# Altium schematic sheet Power.SchDoc
size A; SheetNumber: roneV11-Power; SheetTotal: 6
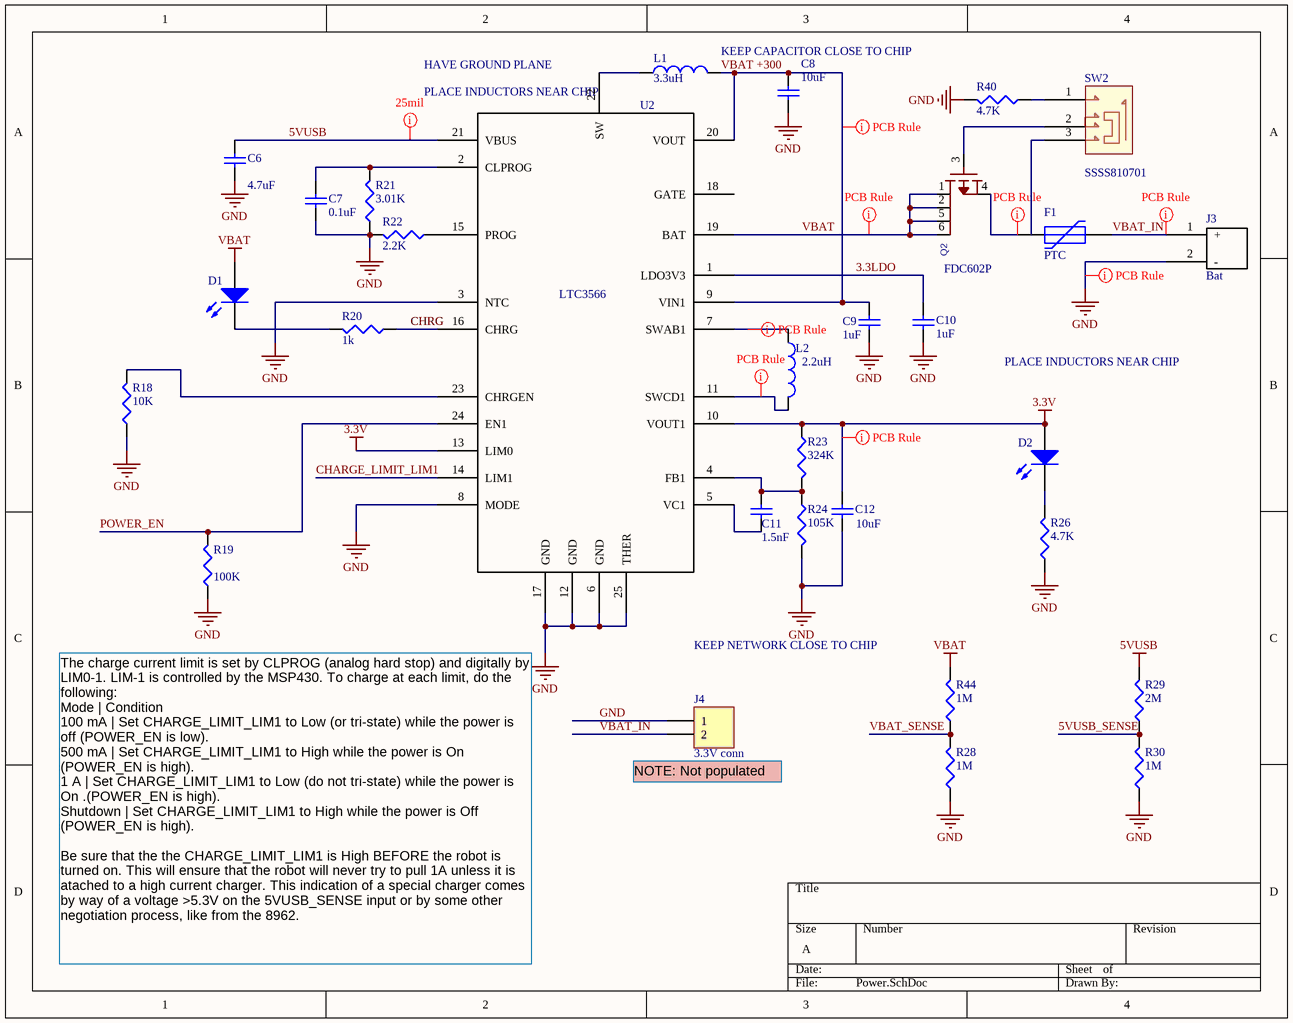
[diagram p0: Power.SchDoc]

## Parts
C6  value 4.7uF  [CAPC1608L]  (hidden comment: Cap Semi)
C7  value 0.1uF  [CAPC1005L]  (hidden comment: Cap)
C8  value 10uF  [CAPC1608L]  (hidden comment: Cap)
C9  value 1uF  [CAPC1608L]  (hidden comment: Cap)
C10  value 1uF  [CAPC1608L]  (hidden comment: Cap)
C11  value 1.5nF  [CAPC1005L]  (hidden comment: Cap)
C12  value 10uF  [CAPC1608L]  (hidden comment: Cap)
D1  Charge  [INDC2012L]  (value not drawn)
D2  Power  [INDC2012L]  (value not drawn)
F1  PTC  [ERJ8G-1206]
J3  Bat  [BatteryConnJST]
J4  3.3V conn  [HDR1X2]
L1  3.3uH  [IndPow]
L2  2.2uH  [IndPow]
Q2  Part Number: FDC602P  [SOT23-6]  (hidden comment: Q_MOSFETP4D_SOT23-6)
R18  value 10K  [RESC1608L]  (hidden comment: Res3)
R19  value 100K  [RESC1608L]  (hidden comment: Res3)
R20  value 1k  [RESC1608L]  (hidden comment: Res3)
R21  value 3.01K  [RESC1608L]  (hidden comment: Res3)
R22  value 2.2K  [RESC1608L]  (hidden comment: Res3)
R23  value 324K  [RESC1608L]  (hidden comment: Res3)
R24  value 105K  [RESC1608L]  (hidden comment: Res3)
R26  value 4.7K  [RESC1608L]  (hidden comment: Res3)
R28  value 1M  [RESC1608L]  (hidden comment: Res3)
R29  value 2M  [RESC1608L]  (hidden comment: Res3)
R30  value 1M  [RESC1608L]  (hidden comment: Res3)
R40  value 4.7K  [RESC1608L]  (hidden comment: Res3)
R44  value 1M  [RESC1608L]  (hidden comment: Res3)
SW2  S_SSSS810701_SSSS810701  [SSSS810701]  (value not drawn)
U2  LTC3566  [QFN-24]

## Nets
3.3V: C12.2 D2.1(A) R23.1 U2.10(VOUT1) U2.13(LIM0)
5VUSB: C6.2 R29.2 U2.21(VBUS)
GND: C6.1 C7.1 C8.1 C9.2 C10.2 C12.1 J3.2(-) J4.1 R18.1 R19.1 R21.1 R22.2 R24.2 R26.1 R28.1 R30.1 R40.2 U2.3(NTC) U2.6(GND) U2.8(MODE) U2.12(GND) U2.17(GND) U2.25(THER)
VBAT: D1.1(A) Q2.1(D) Q2.2(D) Q2.5(D) Q2.6(D) R44.2 U2.19(BAT)
3.3LDO: C10.1 U2.1(LDO3V3)
5VUSB_SENSE: R29.1 R30.2
CHARGE_LIMIT_LIM1: U2.14(LIM1)
CHRG: R20.1 U2.16(CHRG)
POWER_EN: R19.2 U2.24(EN1)
VBAT +300: C8.2 C9.1 L1.2 U2.9(VIN1) U2.20(VOUT)
VBAT_IN: F1.2 J3.1(+) J4.2
VBAT_SENSE: R28.2 R44.1
NetC7_2: C7.2 R21.2 U2.2(CLPROG)
NetC11_1: C11.1 R23.2 R24.1 U2.4(FB1)
NetC11_2: C11.2 U2.5(VC1)
NetD1_2: D1.2(K) R20.2
NetD2_2: D2.2(K) R26.2
NetF1_1: F1.1 Q2.4(S)
NetL1_1: L1.1 U2.22(SW)
NetL2_1: L2.1 U2.7(SWAB1)
NetL2_2: L2.2 U2.11(SWCD1)
NetQ2_3: Q2.3(G) SW2.2
NetR18_2: R18.2 U2.23(CHRGEN)
NetR22_1: R22.1 U2.15(PROG)
NetR40_1: R40.1 SW2.1

Not connected (* = marked no-connect by the designer): SW2 3; U2 18(GATE)

## Layout directives
rule Width Constraint [Pref Width = 25mil    Min Width = 10mil    Max Width = 25mil]: 5VUSB, GND, NetL2_1, NetL2_2, VBAT +300
rule Width Constraint [Pref Width = 25mil    Min Width = 10mil    Max Width = 100mil]: 3.3V
rule Width Constraint [Pref Width = 25mil    Min Width = 10mil    Max Width = 50mil]: NetF1_1, VBAT
rule Width Constraint [Pref Width = 25mil    Min Width = 10mil    Max Width = 40mil]: VBAT_IN

## Notes on the sheet
- (near U2) HAVE GROUND PLANE
- (near U2) PLACE INDUCTORS NEAR CHIP
- KEEP CAPACITOR CLOSE TO CHIP
- CHRG
- PLACE INDUCTORS NEAR CHIP
- KEEP NETWORK CLOSE TO CHIP
- (near J4) NOTE: Not populated
- The charge current limit is set by CLPROG (analog hard stop) and digitally by LIM0-1. LIM-1 is controlled by the MSP430. To charge at each limit, do the following:
  Mode	| Condition
  100 mA	| Set CHARGE_LIMIT_LIM1 to Low (or tri-state) while the power is off (POWER_EN is low).
  500 mA	| Set CHARGE_LIMIT_LIM1 to High while the power is On (POWER_EN is high).
  1 A	| Set CHARGE_LIMIT_LIM1 to Low (do not tri-state) while the power is On .(POWER_EN is high).
  Shutdown | Set CHARGE_LIMIT_LIM1 to High while the power is Off (POWER_EN is high).
  Be sure that the the CHARGE_LIMIT_LIM1 is High BEFORE the robot is turned on. This will ensure that the robot will never try to pull 1A unless it is atached to a high current charger. This indication of a special charger comes by way of a voltage >5.3V on the 5VUSB_SENSE input or by some other negotiation process, like from the 8962.

## Library data of the parts
C6 = Cap Semi: Capacitor (Semiconductor SIM Model); Part Number: JMK107BJ475KA-T; Manufacturer: Taiyo Yuden; Published: 8-Jun-2000; LatestRevisionDate: 29-May-2009; LatestRevisionNote: IPC-7351 Footprint Added.; PackageReference: C1206; Publisher: Altium Limited; PackageDescription: Chip Capacitor
C7 = Cap: Capacitor; Part Number: GRM155R71C104KA88D; Manufacturer: Murata; Published: 8-Jun-2000; LatestRevisionDate: 17-Jul-2002; LatestRevisionNote: Re-released for DXP Platform.; PackageReference: RAD-0.3; Publisher: Altium Limited
C8 C12 = Cap: Capacitor; Part Number: GRM188R60J106ME47J; Manufacturer: Murata; Published: 8-Jun-2000; LatestRevisionDate: 17-Jul-2002; LatestRevisionNote: Re-released for DXP Platform.; PackageReference: RAD-0.3; Publisher: Altium Limited
C9 C10 = Cap: Capacitor; Part Number: LMK107B7105KA-T; Manufacturer: Taiyo Yuden; Published: 8-Jun-2000; LatestRevisionDate: 17-Jul-2002; LatestRevisionNote: Re-released for DXP Platform.; PackageReference: RAD-0.3; Publisher: Altium Limited
C11 = Cap: Capacitor; Part Number: GRM155R71H152KA01D; Manufacturer: Murata; Published: 8-Jun-2000; LatestRevisionDate: 17-Jul-2002; LatestRevisionNote: Re-released for DXP Platform.; PackageReference: RAD-0.3; Publisher: Altium Limited
D1 = LED2: Typical RED, GREEN, YELLOW, AMBER GaAs LED; Part Number: LTST-C190AKT; Manufacturer: Lite-on; Published: 8-Jun-2000; LatestRevisionDate: 17-Jul-2002; LatestRevisionNote: Re-released for DXP Platform.; PackageVersion: Feb-2002; PackageReference: 3.2X1.6X1.1; Publisher: Altium Limited
D2 = LED2: Typical RED, GREEN, YELLOW, AMBER GaAs LED; Part Number: LS Q976-nR-1; Manufacturer: Osram; Published: 8-Jun-2000; LatestRevisionDate: 17-Jul-2002; LatestRevisionNote: Re-released for DXP Platform.; PackageVersion: Feb-2002; PackageReference: 3.2X1.6X1.1; Publisher: Altium Limited
F1 = PTC_FUSE: Fuse; Part Number: MF-NSMF200-2; Manufacturer: Bourns; Published: 8-Jun-2000; LatestRevisionDate: 17-Jul-2002; LatestRevisionNote: Re-released for DXP Platform.; PackageReference: PIN-W2/E2.8; Publisher: Altium Limited
J3 = BatteryConnJST: Part Number: B2B-PH-K-S(LF)(SN); Manufacturer: JST
J4 = Header 2: Header, 2-Pin; LatestRevisionDate: 17-Jul-2002; LatestRevisionNote: Re-released for DXP Platform.; Publisher: Altium Limited; DNI: DNI
L1 = Inductor: Part Number: LPS 4018-332MLB; Manufacturer: Coilcraft; Value: 3.3uH
L2 = Inductor: Part Number: LPS 4018-222MLB; Manufacturer: Coilcraft; Value: 2.2uH
Q2 = Q00101: Manufacturer: Fairchild; CPN: Q00101; Rating: -20V -5.5A; Title: Mosfet P-CH -20V -5.5A .035 Ohm SOT23-6; Category Letter: Q; Category: Transistor; HelpURL: https://rt3.ciholas.com/parts/Q00101; Supplier 2: Newark; Supplier Part Number 2: 58K8817; Supplier 3: Mouser; Supplier Part Number 3: 512-FDC602P
R18 = Res3: Resistor; Part Number: 71-CRCW0603-10K-E3; Manufacturer: Vishay Dale; Published: 8-Jun-2000; LatestRevisionDate: 29-May-2009; LatestRevisionNote: IPC-7351 Footprint Added.; PackageReference: J1-0603; Publisher: Altium Limited; PackageDescription: Chip Resistor
R19 = Res3: Resistor; Part Number: ERJ-3GEYJ104V; Manufacturer: Panasonic; Published: 8-Jun-2000; LatestRevisionDate: 29-May-2009; LatestRevisionNote: IPC-7351 Footprint Added.; PackageReference: J1-0603; Publisher: Altium Limited; PackageDescription: Chip Resistor
R20 = Res3: Resistor; Part Number: ERJ-3GEYJ102V; Manufacturer: Panasonic; Published: 8-Jun-2000; LatestRevisionDate: 29-May-2009; LatestRevisionNote: IPC-7351 Footprint Added.; PackageReference: J1-0603; Publisher: Altium Limited; PackageDescription: Chip Resistor
R21 = Res3: Resistor; Part Number: RMCF0603FT3K01; Manufacturer: Stackpole; Published: 8-Jun-2000; LatestRevisionDate: 29-May-2009; LatestRevisionNote: IPC-7351 Footprint Added.; PackageReference: J1-0603; Publisher: Altium Limited; PackageDescription: Chip Resistor
R22 = Res3: Resistor; Part Number: ERJ-3GEYJ-222V; Manufacturer: Panasonic; Published: 8-Jun-2000; LatestRevisionDate: 29-May-2009; LatestRevisionNote: IPC-7351 Footprint Added.; PackageReference: J1-0603; Publisher: Altium Limited; PackageDescription: Chip Resistor
R23 = Res3: Resistor; Part Number: RC0603FR-07324KL; Manufacturer: Yageo; Published: 8-Jun-2000; LatestRevisionDate: 29-May-2009; LatestRevisionNote: IPC-7351 Footprint Added.; PackageReference: J1-0603; Publisher: Altium Limited; PackageDescription: Chip Resistor
R24 = Res3: Resistor; Part Number: RMCF 1/16 105K 1% R; Manufacturer: Stackpole; Published: 8-Jun-2000; LatestRevisionDate: 29-May-2009; LatestRevisionNote: IPC-7351 Footprint Added.; PackageReference: J1-0603; Publisher: Altium Limited; PackageDescription: Chip Resistor
R26 R40 = Res3: Resistor; Part Number: ERJ-3GEYJ472V; Manufacturer: Panasonic; Published: 8-Jun-2000; LatestRevisionDate: 29-May-2009; LatestRevisionNote: IPC-7351 Footprint Added.; PackageReference: J1-0603; Publisher: Altium Limited; PackageDescription: Chip Resistor
R28 R44 = Res3: Resistor; Part Number: ERJ-3GEY-J105V; Manufacturer: Panasonic; Published: 8-Jun-2000; LatestRevisionDate: 29-May-2009; LatestRevisionNote: IPC-7351 Footprint Added.; PackageReference: J1-0603; Publisher: Altium Limited; PackageDescription: Chip Resistor
R29 R30 = Res3: Resistor; Part Number: ERJ-3GEY-J205V; Manufacturer: Panasonic; Published: 8-Jun-2000; LatestRevisionDate: 29-May-2009; LatestRevisionNote: IPC-7351 Footprint Added.; PackageReference: J1-0603; Publisher: Altium Limited; PackageDescription: Chip Resistor
SW2 = S_SSSS810701_SSSS810701: SSSS810701; Manufacturer: Alps; FabLevel: SurfaceMount; Part Number: SSSS810701
U2 = LTC3566: Part Number: LTC3566EUF#PBF; Manufacturer: Linear